# EAGLE design OpenSoundAnalog (EAGLE 6.6.0)
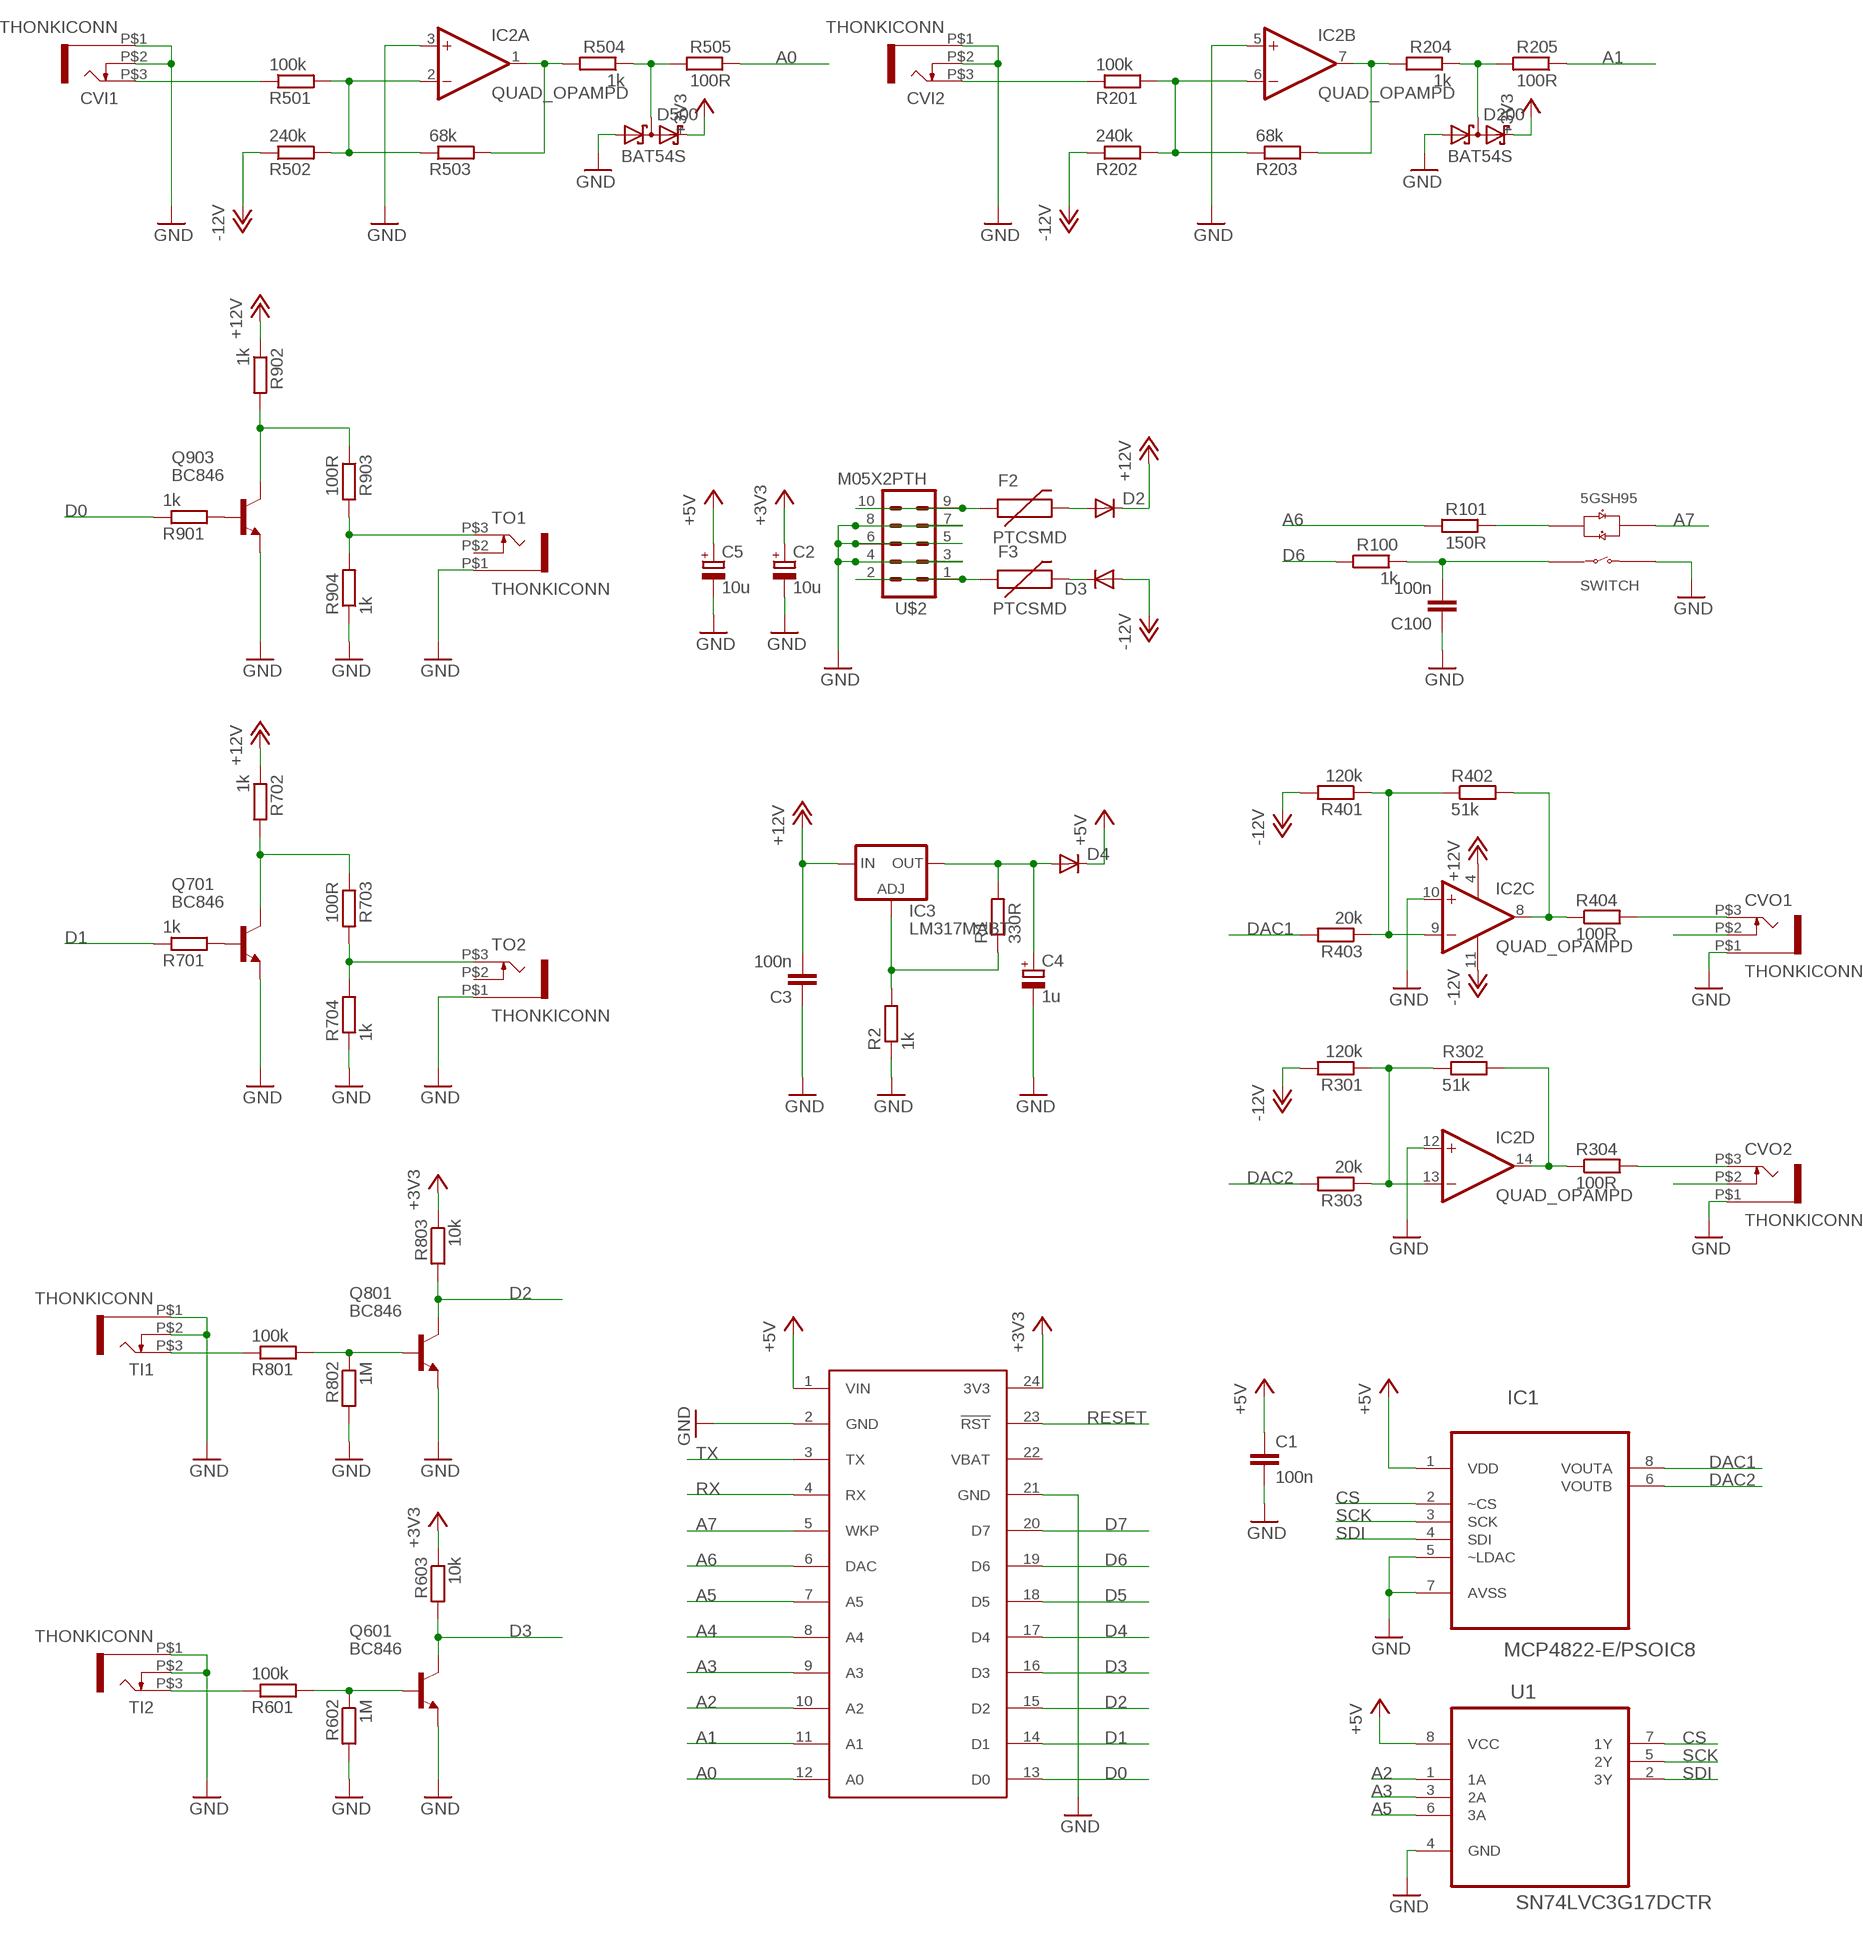
[diagram p0: schematic, sheet 1]

## Parts
C1  100n  C-EUC0603  [C0603]
C2  10u  CPOL-EUSANYO_SMD_A5  [SANYO-OSCON_SMD_A5]
C3  100n  C-EUC0603  [C0603]
C4  1u  CPOL-EUSANYO_SMD_A5  [SANYO-OSCON_SMD_A5]
C5  10u  CPOL-EUSANYO_SMD_A5  [SANYO-OSCON_SMD_A5]
C100  100n  C-EUC0603  [C0603]
CVI1  THONKICONN  [THONKICONN]
CVI2  THONKICONN  [THONKICONN]
CVO1  THONKICONN  [THONKICONN]
CVO2  THONKICONN  [THONKICONN]
D2  DIODESMA  [SMA-DIODE]
D3  DIODESMA  [SMA-DIODE]
D4  DIODESMA  [SMA-DIODE]
D200  BAT54S  [SOT23]
D500  BAT54S  [SOT23]
F2  PTCSMD  [PTC-1206]
F3  PTCSMD  [PTC-1206]
IC1  MCP4822-E/PSOIC8  [SOIC8]
IC2  QUAD_OPAMPD  [SO14]
IC3  LM317MABT  [TO220L1]
Q601  BC846  [SOT23]
Q701  BC846  [SOT23]
Q801  BC846  [SOT23]
Q903  BC846  [SOT23]
R1  330R  R-EU_0603  [0603]
R2  1k  R-EU_0603  [0603]
R100  1k  R-EU_0603  [0603]
R101  150R  R-EU_0603  [0603]
R201  100k  R-EU_0603  [0603]
R202  240k  R-EU_0603  [0603]
R203  68k  R-EU_0603  [0603]
R204  1k  R-EU_0603  [0603]
R205  100R  R-EU_0603  [0603]
R301  120k  R-EU_0603  [0603]
R302  51k  R-EU_0603  [0603]
R303  20k  R-EU_0603  [0603]
R304  100R  R-EU_0603  [0603]
R401  120k  R-EU_0603  [0603]
R402  51k  R-EU_0603  [0603]
R403  20k  R-EU_0603  [0603]
R404  100R  R-EU_0603  [0603]
R501  100k  R-EU_0603  [0603]
R502  240k  R-EU_0603  [0603]
R503  68k  R-EU_0603  [0603]
R504  1k  R-EU_0603  [0603]
R505  100R  R-EU_0603  [0603]
R601  100k  R-EU_0603  [0603]
R602  1M  R-EU_0603  [0603]
R603  10k  R-EU_0603  [0603]
R701  1k  R-EU_0603  [0603]
R702  1k  R-EU_0603  [0603]
R703  100R  R-EU_0603  [0603]
R704  1k  R-EU_0603  [0603]
R801  100k  R-EU_0603  [0603]
R802  1M  R-EU_0603  [0603]
R803  10k  R-EU_0603  [0603]
R901  1k  R-EU_0603  [0603]
R902  1k  R-EU_0603  [0603]
R903  100R  R-EU_0603  [0603]
R904  1k  R-EU_0603  [0603]
SPARK  SPARK_CORE  SPARK_CORECORE  [SPARK_CORE]
TI1  THONKICONN  [THONKICONN]
TI2  THONKICONN  [THONKICONN]
TO1  THONKICONN  [THONKICONN]
TO2  THONKICONN  [THONKICONN]
U1  SN74LVC3G17DCTR  [SOP65P400X130-8N]
U$1  5GTH9  [5GTH9]
U$2  M05X2PTH  [AVR_ICSP]

## Nets
+3V3: C2.+ D200.2(C2) D500.2(C2) R603.1 R803.1 SPARK.24(3V3)
+5V: C1.1 C5.+ D4.C IC1.1(VDD) SPARK.1(VIN) U1.8(VCC)
+12V: C3.2 D2.C IC2.4(P:V+) IC3.3(IN) R702.1 R902.1
-12V: D3.A IC2.11(P:V-) R202.1 R301.2 R401.2 R502.1
A0: R505.1 SPARK.12(A0)
A1: R205.1 SPARK.11(A1)
A2: SPARK.10(A2) U1.1(1A)
A3: SPARK.9(A3) U1.3(2A)
A4: SPARK.8(A4)
A5: SPARK.7(A5) U1.6(3A)
A6: R101.2 SPARK.6(DAC)
A7: SPARK.5(WKP) U$1.+3(LED_R+)
CS: IC1.2(~CS) U1.7(1Y)
D0: R901.1 SPARK.13(D0)
D1: R701.1 SPARK.14(D1)
D2: Q801.3(C) R803.2 SPARK.15(D2)
D3: Q601.3(C) R603.2 SPARK.16(D3)
D4: SPARK.17(D4)
D5: SPARK.18(D5)
D6: R100.2 SPARK.19(D6)
D7: SPARK.20(D7)
DAC1: IC1.8(VOUTA) R403.2
DAC2: IC1.6(VOUTB) R303.2
GND: C1.2 C2.- C3.1 C4.- C5.- C100.1 CVI1.P$1 CVI1.P$2 CVI2.P$1 CVI2.P$2 CVO1.P$1 CVO2.P$1 D200.1(A1) D500.1(A1) IC1.5(~LDAC) IC1.7(AVSS) IC2.3(A:+IN) IC2.5(B:+IN) IC2.10(C:+IN) IC2.12(D:+IN) Q601.2(E) Q701.2(E) Q801.2(E) Q903.2(E) R2.1 R602.2 R704.1 R802.2 R904.1 SPARK.2(GND) SPARK.21(GND) TI1.P$1 TI1.P$2 TI2.P$1 TI2.P$2 TO1.P$1 TO2.P$1 U1.4(GND) U$1.1(SWITCH_B) U$2.3 U$2.4 U$2.5 U$2.6 U$2.7 U$2.8
N$1: R703.2 R704.2 TO2.P$3
N$2: Q903.1(B) R901.2
N$3: IC2.14(D:OUT) R302.2 R304.1
N$4: Q903.3(C) R902.2 R903.1
N$5: R903.2 R904.2 TO1.P$3
N$6: F3.1 U$2.1 U$2.2
N$7: IC2.8(C:OUT) R402.2 R404.1
N$8: CVO1.P$2
N$9: Q801.1(B) R801.2 R802.1
N$10: R801.1 TI1.P$3
N$11: CVI1.P$3 R501.1
N$13: IC2.9(C:-IN) R401.1 R402.1 R403.1
N$14: IC2.2(A:-IN) R501.2 R502.2 R503.1
N$15: IC2.13(D:-IN) R301.1 R302.1 R303.1
N$16: D500.3(C1A2) R504.1 R505.2
N$17: IC2.1(A:OUT) R503.2 R504.2
N$18: CVI2.P$3 R201.1
N$19: IC3.1(ADJ) R1.1 R2.2
N$20: IC2.6(B:-IN) R201.2 R202.2 R203.1
N$21: C4.+ D4.A IC3.2(OUT) R1.2
N$22: IC2.7(B:OUT) R203.2 R204.2
N$23: R601.1 TI2.P$3
N$24: D200.3(C1A2) R204.1 R205.2
N$25: D3.C F3.2
N$26: D2.A F2.2
N$27: Q601.1(B) R601.2 R602.1
N$28: R101.1 U$1.-2(LED_G+)
N$29: CVO2.P$2
N$31: CVO1.P$3 R404.2
N$32: CVO2.P$3 R304.2
N$34: Q701.1(B) R701.2
N$38: Q701.3(C) R702.2 R703.1
N$45: F2.1 U$2.9 U$2.10
RESET: SPARK.23(!RST)
RX: SPARK.4(RX)
SCK: IC1.3(SCK) U1.5(2Y)
SDI: IC1.4(SDI) U1.2(3Y)
SWITCH_A: C100.2 R100.1 U$1.4(SWITCH_A)
TX: SPARK.3(TX)
Unconnected: TO1.P$2 TO2.P$2

## Power pins joined to a net without a drawn wire
VBAT: SPARK.22(VBAT)

## Library data of the parts
C1 = resistor:C-EU: CAPACITOR, European symbol
C2 C4 C5 = rcl:CPOL-EU: POLARIZED CAPACITOR, European symbol
C3 C100 = rcl:C-EU: CAPACITOR, European symbol
CVI1 CVI2 CVO1 CVO2 TI1 TI2 TO1 TO2 = Rebel:THONKICONN
D2-D4 = SparkFun:DIODE: Diode These are standard reverse protection diodes and small signal diodes. SMA package can handle up to about 1A. SOD-323 can handle about 200mA. What the SOD-323 package when ordering, there are some mfgs out there that are 5-pin packages.
D200 D500 = diode:BAT54S: Schottky Diodes Pin connection corrected 2011-05-04 Source: Fairchild .. BAT54.pdf
F2 F3 = SparkFun:PTC: Resettable Fuse PTC Resettable Fuse. Spark Fun Electronics SKU : COM-08357
IC1 = Rebel:MCP4822-E/P: DAC
IC2 = adafruit:QUAD_OPAMP: OP AMP Standard quad package
IC3 = v-reg:LM317?*: 500 mA Adjustable Output Positive Voltage Regulator Source: http://www.onsemi.co.jp .. LM317M-D.PDF
Q601 Q701 Q801 Q903 = transistor:BC846: NPN TRANSISTOR
R1 R2 R100 R101 R201-R205 R301-R304 R401-R404 R501-R505 R601-R603 R701-R704 R801-R803 R901-R904 = Rebel:R-EU_: RESISTOR, European symbol
SPARK = Spark:SPARK_CORE
U1 = Rebel:SN74LVC3G17DCTR: TRIPLE SCHMITT-TRIGGER BUFFER; MPN: SN74LVC3G17DCTR; OC_FARNELL: 1236391; OC_NEWARK: 90H3713; PACKAGE: SSOP-8; SUPPLIER: Texas Instruments
U$1 = SWITCH-5GTH9:5GTH9
U$2 = SparkFun-Connectors:M05X2: Header 5x2 Standard 10-pin dual row 0.1" header. Commonly used with AVR-ISP. Use with Spark Fun Electronics SKU: PRT-00778

## Board
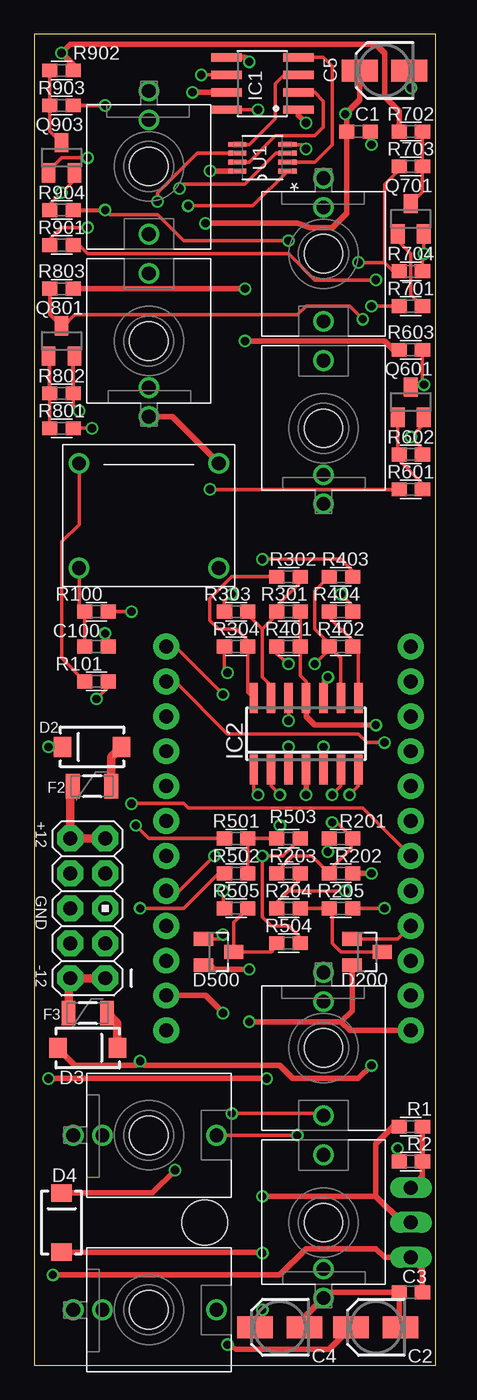
[diagram p1: board, top side]
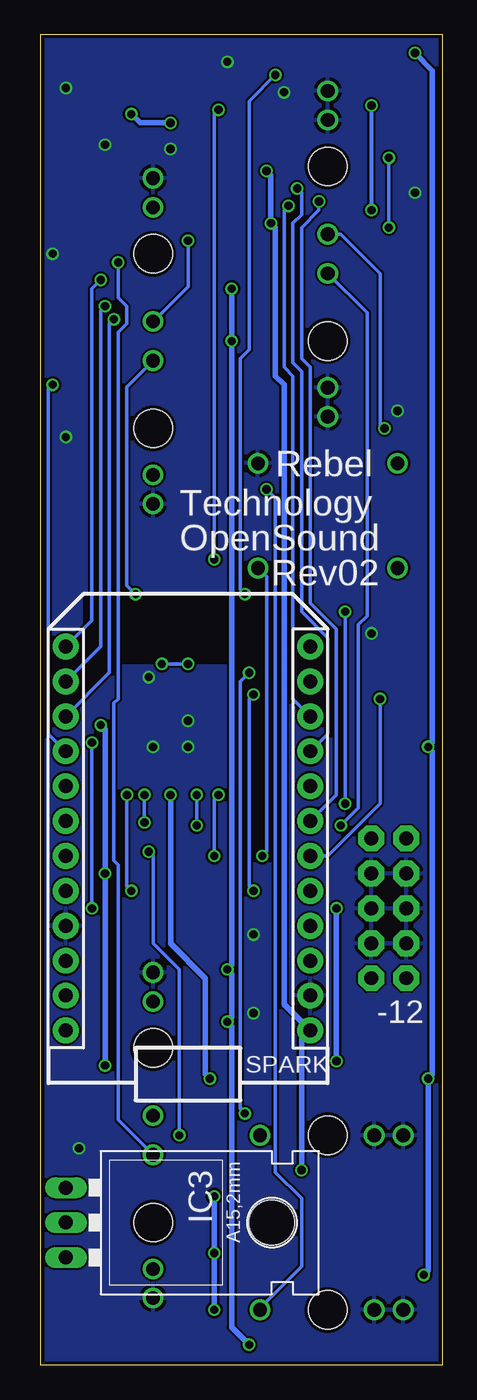
[diagram p2: board, bottom side, seen from below]

Size 29.2 x 96.83 mm. Coordinates in mm from the lower left corner, seen from the top.
Outline: 29.2,0 29.2,96.83 0,96.83 0,0 29.2,0
Copper layers (1*16): Top 0.035mm / dielectric 1.5mm / Bottom 0.035mm
Design rules "Fusion_eagle_rule_v1.1": minimum track width 6mil, minimum drill 12mil, track to track 6mil, track to pad 6mil, pad to pad 6mil, via to via 6mil, smd to smd 0mil, copper to edge 10mil, drill to drill 10mil, minimum pad ring 10mil, minimum via ring 6mil, stop-mask expansion 2mil, vias tented up to drill 100mil, thermal gap 10mil

### Footprints (pad centres in the part's own frame; a part is rotated, then mirrored left to right if it is on the bottom)
C0603 = smd 1.1 x 1: 1 -0.85,0; 2 0.85,0
SANYO-OSCON_SMD_A5 = smd 2.6 x 1.6: + 1.8,0; - -1.8,0
THONKICONN = drill 1: P$1 0,-5.5; P$2 0,-3.38; P$3 0,4.92 | hole 2.8: 0,0
SMA-DIODE = smd 1.27 x 1.47: A -2.15,0; C 2.15,0
SOT23 = smd 1 x 1.4: 1 -0.95,-1.1; 2 0.95,-1.1; 3 0,1.1
PTC-1206 = smd 1 x 1.8: 1 -1.4,0; 2 1.4,0
SOIC8 = smd 0.61 x 2.21: 1 -1.905,-2.616; 2 -0.635,-2.616; 3 0.635,-2.616; 4 1.905,-2.616; 5 1.905,2.616; 6 0.635,2.616; 7 -0.635,2.616; 8 -1.905,2.616
SO14 = smd 0.6 x 2.2: 1 -3.81,-2.6; 2 -2.54,-2.6; 3 -1.27,-2.6; 4 0,-2.6; 5 1.27,-2.6; 6 2.54,-2.6; 7 3.81,-2.6; 8 3.81,2.6; 9 2.54,2.6; 10 1.27,2.6; 11 0,2.6; 12 -1.27,2.6; 13 -2.54,2.6; 14 -3.81,2.6
TO220L1 = drill 1.016 long: 1 -2.54,-3.81; 2 0,-3.81; 3 2.54,-3.81 | hole 3.302: 0,11.176
0603 = smd 1.1 x 1: 1 -0.85,0; 2 0.85,0
SPARK_CORE = drill 1.016 pad 1.88: 1 -8.89,13.97; 2 -8.89,11.43; 3 -8.89,8.89; 4 -8.89,6.35; 5 -8.89,3.81; 6 -8.89,1.27; 7 -8.89,-1.27; 8 -8.89,-3.81; 9 -8.89,-6.35; 10 -8.89,-8.89; 11 -8.89,-11.43; 12 -8.89,-13.97; 13 8.89,-13.97; 14 8.89,-11.43; 15 8.89,-8.89; 16 8.89,-6.35; 17 8.89,-3.81; 18 8.89,-1.27; 19 8.89,1.27; 20 8.89,3.81; 21 8.89,6.35; 22 8.89,8.89; 23 8.89,11.43; 24 8.89,13.97
SOP65P400X130-8N = smd 1.321 x 0.356: 1 -1.829,0.965; 2 -1.829,0.33; 3 -1.829,-0.33; 4 -1.829,-0.965; 5 1.829,-0.965; 6 1.829,-0.33; 7 1.829,0.33; 8 1.829,0.965
5GTH9 = drill 1: 1 5.08,3.81; 4 -5.08,-3.81; +3 5.08,-3.81; -2 -5.08,3.81
AVR_ICSP = drill 1.016 pad 1.88 octagon: 1 -1.27,5.08; 2 1.27,5.08; 3 -1.27,2.54; 4 1.27,2.54; 5 -1.27,0; 6 1.27,0; 7 -1.27,-2.54; 8 1.27,-2.54; 9 -1.27,-5.08; 10 1.27,-5.08

### Placement (x,y rotation side)
C1  23.57,89.75 0 top
C2  24.84,2.76 180 top
C3  27.38,5.3 0 top
C4  17.85,2.76 180 top
C5  25.47,94.2 180 top
C100  4.52,52.29 180 top
CVI1  8.33,74.51 0 top
CVI2  8.33,16.73 270 top
CVO1  21.03,68.16 0 top
CVO2  21.03,23.08 180 top
D2  4.2,44.98 180 top
D3  3.88,23.08 0 top
D4  1.98,10.38 90 top
D200  24.2,30.06 270 top
D500  13.41,30.06 270 top
F2  4.2,42.13 0 top
F3  3.88,25.62 0 top
IC1  16.58,93.24 90 top
IC2  19.76,45.94 0 top
IC3  23.57,10.38 270 bottom
Q601  27.38,70.07 0 top
Q701  27.38,83.4 0 top
Q801  1.98,74.51 0 top
Q903  1.98,87.85 0 top
R1  27.38,17.36 180 top
R2  27.38,14.82 0 top
R100  4.52,54.83 0 top
R101  4.52,49.75 0 top
R201  22.3,38.32 0 top
R202  22.3,35.78 180 top
R203  18.49,35.78 0 top
R204  18.49,33.24 180 top
R205  22.3,33.24 180 top
R301  18.49,54.83 0 top
R302  18.49,57.37 180 top
R303  14.68,54.83 180 top
R304  14.68,52.29 180 top
R401  18.49,52.29 0 top
R402  22.3,52.29 0 top
R403  22.3,57.37 0 top
R404  22.3,54.83 0 top
R501  14.68,38.32 0 top
R502  14.68,35.78 0 top
R503  18.49,38.32 0 top
R504  18.49,30.7 0 top
R505  14.68,33.24 0 top
R601  27.38,63.72 0 top
R602  27.38,66.26 0 top
R603  27.38,73.88 0 top
R701  27.38,77.05 0 top
R702  27.38,89.75 0 top
R703  27.38,87.21 180 top
R704  27.38,79.59 180 top
R801  1.98,68.16 180 top
R802  1.98,70.7 0 top
R803  1.98,78.32 180 top
R901  1.98,81.5 180 top
R902  1.98,94.2 180 top
R903  1.98,91.66 0 top
R904  1.98,84.04 0 top
SPARK  18.49,38.32 180 bottom
TI1  8.33,87.21 180 top
TI2  8.33,4.03 270 top
TO1  21.03,80.86 180 top
TO2  21.03,10.38 0 top
U1  16.58,87.85 180 top
U$1  8.33,61.81 0 top
U$2  3.88,33.24 180 top

### Tracks (layer width: path | path; a pad name or v marks a point on that pad's centre or on a via)
+3V3  (via drill 0.6)
  Top 0.406: R803.1 v15.31,78.32 | v14.04,1.49 14.68,1.17 21.45,1.17 C2.+ | R603.1 26.11,73.88 25.47,74.51 v15.31,74.51 | 22.3,24.98 v15.63,24.98 | D500.2 12.77,29.11 13.09,28.79 v15.63,28.79 | D200.2 23.1,25.79 22.3,24.98 | SPARK.24 22.93,24.35 22.3,24.98
  Bottom 0.406: v15.31,78.32 v15.31,74.51 15.31,29.11 v15.63,28.79 15.31,28.47 15.31,25.3 v15.63,24.98 15.31,24.66 15.31,2.76 v14.04,1.49
+5V  (via drill 0.6)
  Top 0.406: D4.C 8.57,12.53 v10.23,14.19 | U1.8 12.79,86.88 v12.77,86.89 | C5.+ 23.67,92.08 v22.62,91.02 22.72,90.92 C1.1 22.72,83.82 21.66,82.77 20.07,82.77 19.12,83.08 v12.45,83.08 | IC1.1 19.2,90.94 v19.76,90.39
  Bottom 0.406: v10.23,14.19 10.23,23.71 SPARK.1 11.5,26.25 11.5,71.34 12.14,71.97 12.14,82.77 v12.45,83.08 12.45,86.58 v12.77,86.89 | v19.76,90.39 21.98,90.39 v22.62,91.02
+12V  (via drill 0.6)
  Top 0.406: 2.61,94.83 v1.98,95.47 2.61,96.1 24.84,96.1 25.47,95.47 25.47,92.29 26.53,91.24 R702.1 | 2.61,94.83 2.61,94.41 R902.1 2.83,94.62 2.61,94.83 | v1.34,6.57 17.85,6.57 19.76,8.47 24.84,8.47 25.47,7.84 IC3.3 28.23,6.99 C3.2 | IC2.4 v19.76,41.49 | v16.9,20.85 v1.02,20.85 | D2.C v1.02,44.98
  Bottom 0.406: v1.98,95.47 0.71,94.2 0.71,45.3 v1.02,44.98 0.71,44.67 0.71,21.17 v1.02,20.85 1.02,6.88 v1.34,6.57 | v19.76,41.49 19.76,30.7 17.22,28.16 17.22,21.17 v16.9,20.85
-12V  (via drill 0.6)
  Top 0.254: R301.2 R401.2 19.34,50.17 19.76,49.75 IC2.11 | v7.69,33.24 10.87,33.24 13.41,35.78 R502.1
  Top 0.406: IC2.11 19.76,47.21 20.39,46.57 v24.84,46.57 | v24.52,35.78 R202.1 | v24.52,21.81 23.57,20.85 18.8,20.85 17.85,21.81 8.01,21.81 v7.69,22.12 7.37,21.81 2.93,21.81 1.73,23 D3.A
  Bottom 0.406: v24.84,46.57 24.52,46.25 v24.52,35.78 v24.52,21.81 | v7.69,33.24 v7.69,22.12
A0  (via drill 0.6)
  Top 0.254: SPARK.12 10.23,52.29 v13.72,48.79 | v13.72,34.51 13.72,33.34 R505.1
  Bottom 0.254: v13.72,48.79 14.04,48.48 14.04,34.82 v13.72,34.51
A1  (via drill 0.6)
  Top 0.254: SPARK.11 10.23,49.75 14.04,45.94 23.57,45.94 24.2,45.3 v25.47,45.3 | v25.47,33.24 R205.1
  Bottom 0.254: v25.47,45.3 v25.47,33.24
A2  (via drill 0.6)
  Top 0.254: v11.19,84.35 15.88,84.35 U1.1
  Bottom 0.254: SPARK.10 10.87,48.48 10.87,71.97 11.5,72.61 11.5,84.04 v11.19,84.35
A3  (via drill 0.6)
  Top 0.254: U1.3 17.55,88.18 15.31,85.94 10.87,85.94 v10.55,85.62
  Bottom 0.254: v10.55,85.62 10.23,85.31 10.23,83.72 10.87,83.08 10.87,72.92 10.23,72.29 10.23,54.83 8.33,52.92 8.33,45.94 SPARK.9
A5  (via drill 0.6)
  Top 0.254: U1.6 11.83,88.18 8.96,85.31 v8.96,84.67
  Bottom 0.254: v8.96,84.67 8.96,84.04 10.23,82.77 10.23,73.24 9.6,72.61 9.6,55.46 7.69,53.56 7.69,41.49 SPARK.7
A6  (via drill 0.6)
  Top 0.254: R101.2 5.37,49.33 v4.52,48.48
  Bottom 0.254: SPARK.6 8.33,37.05 4.52,40.86 v4.52,48.48
A7  (via drill 0.6)
  Top 0.254: SPARK.5 10.55,34.51 v13.09,37.05
  Bottom 0.254: v13.09,37.05 12.77,37.36 12.77,57.37 U$1.+3
CS
  Top 0.254: IC1.2 20.39,92.61 21.03,91.97 21.03,90.07 20.39,89.43 17.53,89.43 15.62,87.52 U1.7
D0  (via drill 0.6)
  Top 0.254: R901.1 3.25,81.5 3.88,80.86 18.49,80.86 20.39,78.96 v24.84,78.96
  Bottom 0.254: v24.84,78.96 25.47,78.32 25.47,54.19 SPARK.13
D1  (via drill 0.6)
  Top 0.254: R701.1 v24.52,77.05
  Bottom 0.254: SPARK.14 24.84,52.29 24.84,76.73 v24.52,77.05
D2  (via drill 0.6)
  Top 0.254: Q801.3 2.13,75.61 2.93,76.42 19.12,76.42 19.76,77.05 22.93,77.05 v23.89,76.1
  Top 0.305: R803.2 1.13,76.46 Q801.3
  Bottom 0.254: v23.89,76.1 24.2,75.78 24.2,50.38 SPARK.15
D3  (via drill 0.6)
  Top 0.254: Q601.3 27.55,71.34 v28.33,71.34 28.23,71.44 R603.2
  Bottom 0.254: SPARK.16 28.65,45.94 28.65,71.02 v28.33,71.34
D6  (via drill 0.6)
  Top 0.254: SPARK.19 23.89,40.54 11.19,40.54 10.87,40.86 v7.06,40.86 | v7.06,54.83 R100.2
  Bottom 0.254: v7.06,40.86 v7.06,54.83
DAC1  (via drill 0.6)
  Top 0.254: R403.2 23.15,57.79 22.3,58.64 v16.58,58.64 | v16.27,91.34 IC1.8
  Bottom 0.254: v16.58,58.64 16.58,91.02 v16.27,91.34
DAC2  (via drill 0.6)
  Top 0.254: IC1.6 v12.14,93.88 | R303.2 13.83,55.56 v14.36,56.1
  Bottom 0.254: v12.14,93.88 14.04,91.97 14.04,73.88 14.68,73.24 14.68,56.41 v14.36,56.1
GND  (via drill 0.6)
  Top 0.254: R802.2 2.83,69.85 v3.25,69.43 | 28.33,79.69 R704.1 28.23,80.76 v28.33,80.86 28.33,81.18 Q701.2 | Q601.2 28.33,68.48 v27.38,67.53 28.23,66.68 R602.2 | Q903.2 2.93,86.26 v1.98,85.31 1.13,84.46 R904.1 | D500.1 13.41,31.01 v13.72,31.33 | U1.4 19.43,88.81 v19.76,88.48 | D200.1 26.43,31.01 SPARK.21 | C100.1 5.37,53.02 v5.15,53.24 | IC2.10 21.03,49.75 v21.34,50.06 | IC2.12 v18.49,46.89
  Top 0.305: R802.2 2.83,73.31 Q801.2
  Top 0.406: R2.1 26.53,15.67 v26.43,15.77 | C4.- 19.65,3.5 TO2.P$1 21.45,5.3 C3.1 26.53,2.87 C2.- | IC1.7 v11.5,92.61 | SPARK.2 12.45,26.89 v13.72,25.62 | IC2.3 v18.49,44.98 | IC2.5 v21.03,44.98 | C5.- 27.27,93.03 v27.38,92.93 | CVI1.P$1 10.02,69.01 U$1.1 | IC1.5 15.31,95.15 v15.63,94.83 | C1.2 24.42,88.9 v24.52,88.8
  pour Bottom: 29.92,-1.05 -1.2,-1.05 -1.2,99.91 29.92,99.91
N$1  (via drill 0.6)
  Top 0.254: R704.2 26.11,79.59 25.47,80.23 | 25.47,80.23 v23.57,80.23 | R703.2 26.53,87 25.47,85.94 25.47,80.23
  Bottom 0.254: v23.57,80.23 23.57,77.69 22.93,77.05 22.93,75.78 23.57,75.15 23.57,48.48 23.89,48.16 23.89,36.73 23.57,36.41 23.57,17.84 TO2.P$3
N$2  (via drill 0.6)
  Top 0.254: 1.03,86.26 Q903.1 1.03,86.9 1.98,87.85 v3.88,87.85 | v3.88,82.77 1.98,82.77 1.13,81.92 R901.2
  Bottom 0.254: v3.88,87.85 v3.88,82.77
N$3
  Top 0.254: IC2.14 15.53,48.96 R304.1 15.53,52.71 14.68,53.56 13.41,53.56 12.77,54.19 12.77,55.78 14.36,57.37 R302.2
N$4
  Top 0.254: Q903.3 1.13,89.8 R903.1 R902.2
N$5  (via drill 0.6)
  Top 0.254: v5.15,84.04 5.47,83.72 8.96,83.72 10.87,81.81 v18.49,81.81
  Top 0.305: R904.2 v5.15,84.04 | R903.2 v5.15,91.66
  Bottom 0.254: v18.49,81.81 18.49,78.48 TO1.P$3
  Bottom 0.305: v5.15,91.66 v5.15,84.04
N$6
  Top 0.61: U$2.1 U$2.2 2.48,28.03 F3.1
N$7
  Top 0.254: R404.1 21.45,54.41 23.15,52.71 R402.2 23.57,51.87 IC2.8
N$9
  Top 0.254: R801.2 R802.1
  Top 0.305: R802.1 1.13,73.31 Q801.1
N$10  (via drill 0.6)
  Top 0.254: R801.1 v4.2,68.16
  Bottom 0.254: v4.2,68.16 4.52,68.48 4.52,79.43 7.38,82.29 TI1.P$3
N$11  (via drill 0.6)
  Top 0.254: R501.1 8.33,38.32 v7.37,39.27
  Bottom 0.254: CVI1.P$3 5.47,76.57 5.47,54.51 6.11,53.87 6.11,40.54 v7.37,39.27
N$13  (via drill 0.6)
  Top 0.254: R402.1 21.45,52.07 v20.39,51.02 | R401.1 17.64,51.75 v18.49,51.02 | R402.1 21.45,52.5 20.39,53.56 20.39,56.31 R403.1 | IC2.9 22.3,51.44 R402.1
  Bottom 0.254: v18.49,51.02 v20.39,51.02
N$14  (via drill 0.6)
  Top 0.254: R502.2 R501.2 R503.1 17.85,38.53 v17.85,39.27 | IC2.2 17.22,42.13 v17.85,41.49
  Bottom 0.254: v17.85,41.49 v17.85,39.27
N$15
  Top 0.254: R303.1 15.53,54.61 16.58,53.56 | 16.58,53.56 16.58,50.06 17.22,49.43 IC2.13 | R302.1 19.34,56.95 17.64,55.25 R301.1 17.64,54.61 16.58,53.56
N$16
  Top 0.254: R505.2 14.51,32.22 D500.3 17.22,30.06 R504.1
N$17  (via drill 0.6)
  Top 0.254: R504.2 19.34,31.12 18.49,31.97 17.22,31.97 16.58,32.6 v16.58,37.05 18.07,37.05 R503.2 | IC2.1 15.95,41.81 v16.27,41.49
  Bottom 0.254: v16.58,37.05 16.58,41.17 v16.27,41.49
N$18  (via drill 0.6)
  Top 0.254: CVI2.P$3 v19.12,16.73 | v21.34,37.36 21.34,38.21 R201.1
  Bottom 0.254: v19.12,16.73 19.12,28.79 21.03,30.7 21.03,37.05 v21.34,37.36
N$19
  Top 0.406: R1.1 R2.2 28.23,13.77 IC3.1
N$20  (via drill 0.6)
  Top 0.254: R203.1 17.85,35.78 17.85,36.09 18.8,37.05 20.18,37.05 R202.2 | 21.66,35.99 R202.2 | R202.2 21.45,35.99 23.03,37.58 23.03,38.2 R201.2 21.98,39.48 v21.66,39.48 | IC2.6 22.3,42.13 v21.66,41.49
  Bottom 0.254: v21.66,41.49 v21.66,39.48
N$21  (via drill 0.6)
  Top 0.406: IC3.2 26.74,10.38 24.84,12.28 | 24.84,12.28 v16.58,12.28 | v16.58,4.03 16.58,3.29 C4.+ | D4.A 16.51,8.23 v16.58,8.15 | R1.2 26.11,17.36 24.84,16.09 24.84,12.28
  Bottom 0.406: v16.58,12.28 v16.58,8.15 v16.58,4.03
N$22  (via drill 0.6)
  Top 0.254: R204.2 17.64,33.66 18.49,34.51 | 18.49,34.51 19.34,35.36 R203.2 | IC2.7 23.57,42.13 v22.93,41.49 | v22.62,34.51 18.49,34.51
  Bottom 0.254: v22.93,41.49 22.93,34.82 v22.62,34.51
N$23  (via drill 0.6)
  Top 0.254: R601.1 v12.77,63.72
  Bottom 0.254: v12.77,63.72 12.14,63.08 12.14,14.03 10.23,12.12 10.23,7.2 13.25,4.19 TI2.P$3
N$24
  Top 0.254: R204.1 R205.2 21.66,33.02 21.66,30.7 22.3,30.06 D200.3
N$25
  Top 0.61: D3.C 6.03,24.87 F3.2
N$26
  Top 0.61: F2.2 5.6,44.23 D2.A
N$27
  Top 0.254: Q601.1 26.43,66.36 R602.1 26.53,65.84 28.23,64.14 R601.2
N$28
  Top 0.254: U$1.-2 3.25,61.18 1.98,59.91 1.98,51.44 R101.1
N$31  (via drill 0.6)
  Top 0.254: R404.2 23.15,55.25 v22.3,56.1
  Bottom 0.254: v22.3,56.1 22.93,56.73 22.93,71.18 CVO1.P$3
N$32  (via drill 0.6)
  Top 0.254: R304.2 13.83,50.6 v14.04,50.38 | v14.36,18.31 20.87,18.31 CVO2.P$3
  Bottom 0.254: v14.04,50.38 14.68,49.75 14.68,18.63 v14.36,18.31
N$34
  Top 0.254: Q701.1 26.43,81.81 27.38,80.86 27.38,77.9 R701.2
N$38
  Top 0.254: R702.2 R703.1 28.23,85.35 Q701.3
N$45
  Top 0.61: U$2.9 U$2.10 2.61,41.68 F2.1
SCK
  Top 0.254: IC1.3 18.17,93.88 17.53,93.24 17.53,90.7 15.64,88.81 U1.5
SDI
  Top 0.254: U1.2 20.38,87.52 21.66,88.8 21.66,94.51 21.03,95.15 IC1.4
SWITCH_A
  Top 0.254: U$1.4 3.25,55.25 R100.1 C100.2

### Text on the board
tPlace: +12 | GND | -12
bPlace: Rebel | Technology | OpenSound | Rev02 | -12